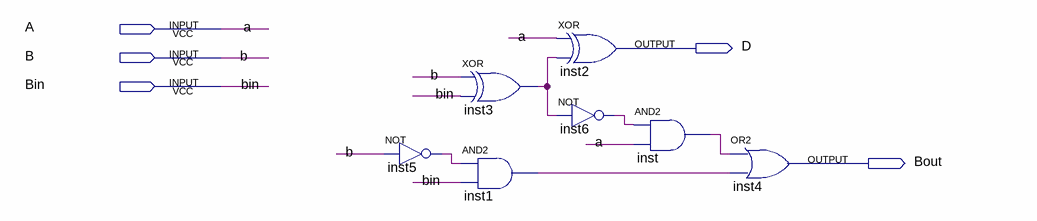
[diagram p0: schematic sheet]
// Quartus schematic full_subtractor.bdf as structural Verilog: 7 symbols, 5 pins
module full_subtractor (
  input  A,
  input  B,
  input  Bin,
  output D,
  output Bout
);

  wire inst1_out, inst3_out, inst5_out, inst6_out, inst_out;

  not inst5 (inst5_out, B);
  xor inst3 (inst3_out, B, Bin);
  and inst1 (inst1_out, inst5_out, Bin);
  xor inst2 (D, A, inst3_out);
  not inst6 (inst6_out, inst3_out);
  and inst (inst_out, inst6_out, A);
  or inst4 (Bout, inst_out, inst1_out);
endmodule
